# Altium project Controller.PrjPcb
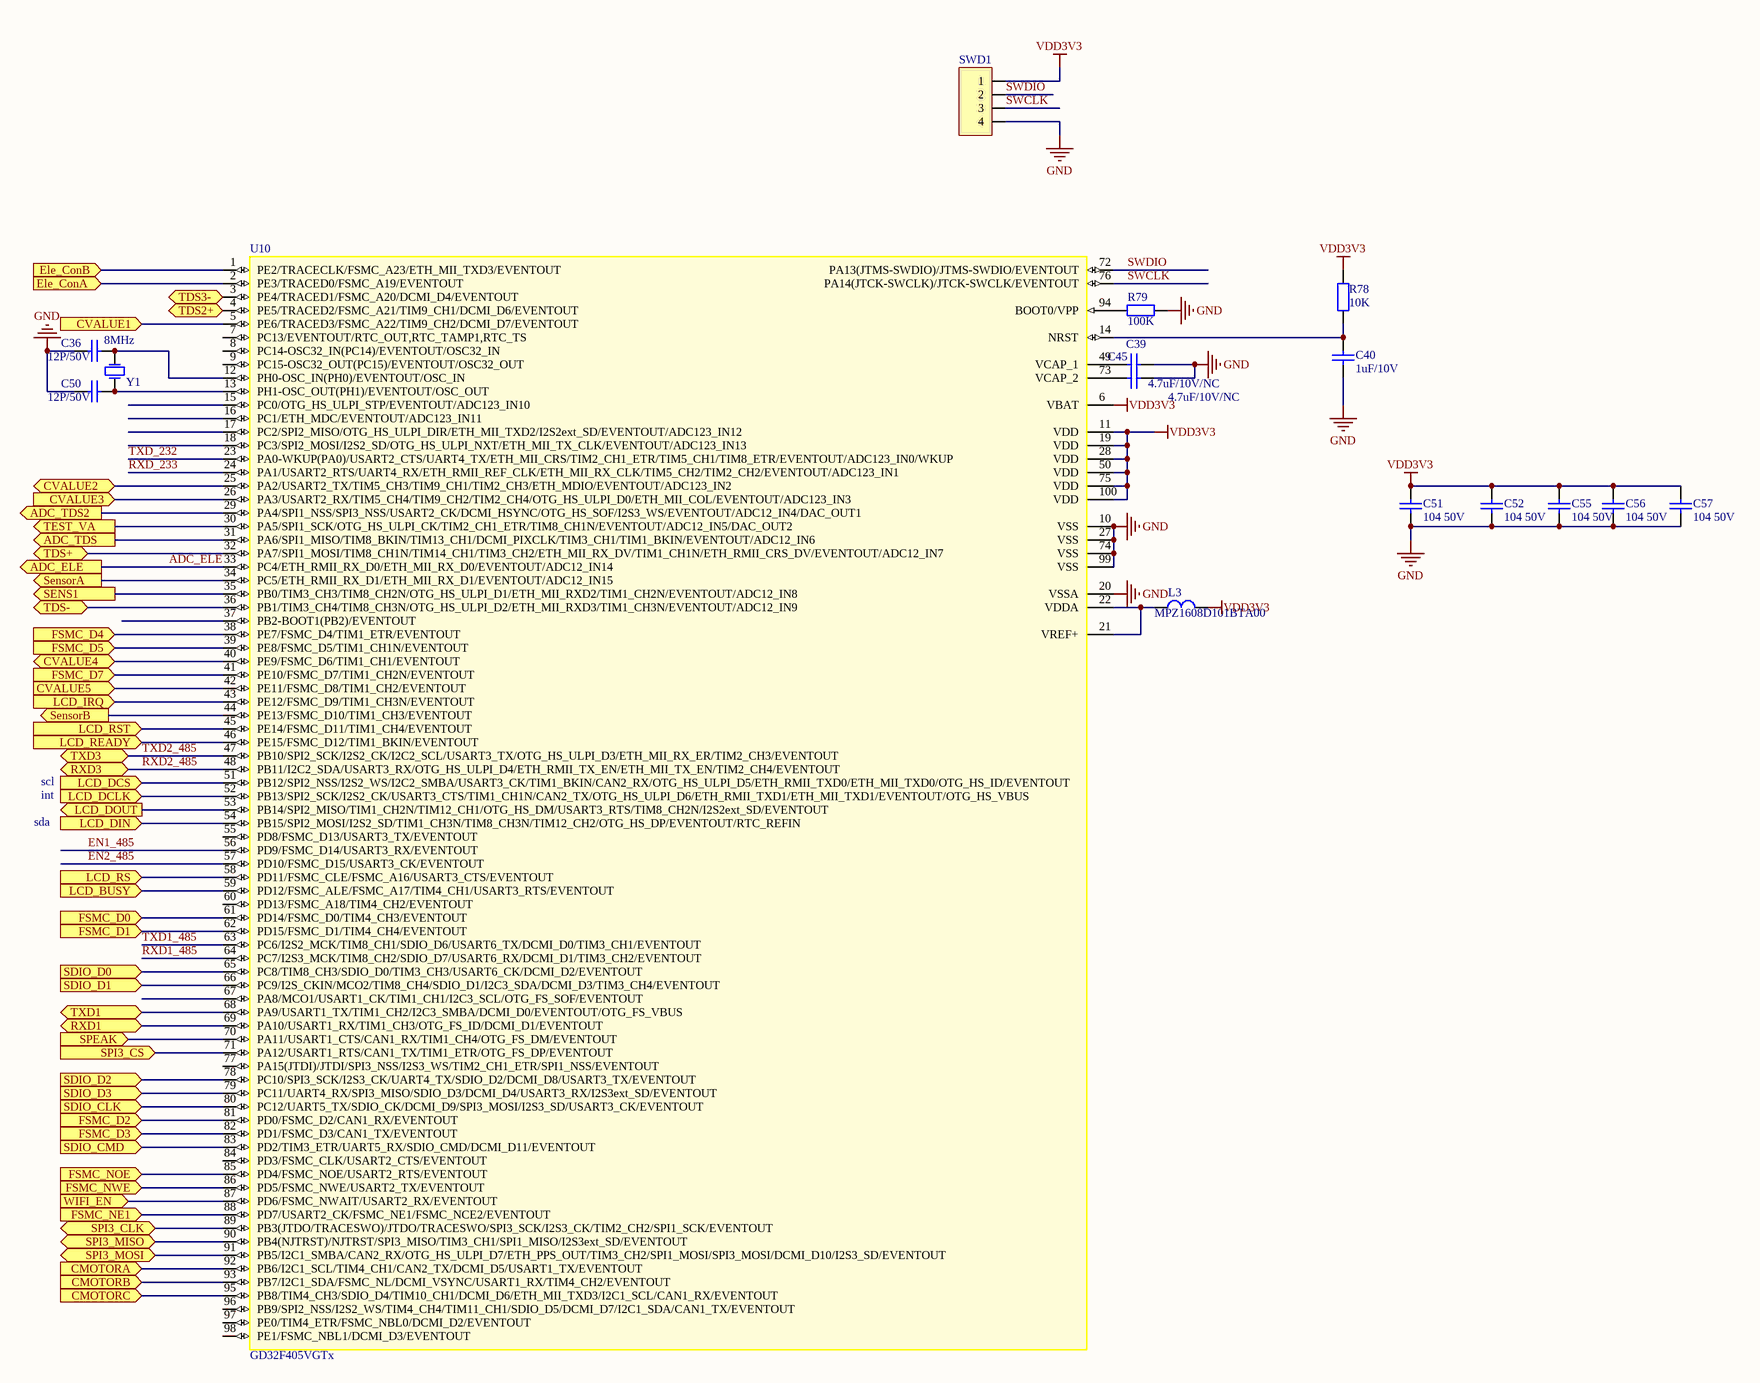
[diagram p0: cpu.SchDoc]
6 sheets, 170 parts. Net scope: global (net labels, ports and power ports of the same name join across sheets).
Board file: 电解模块主控板_V1.1_ZM_20211015.PcbDoc
Sheets:
  cpu.SchDoc
  08_Peripherals.SchDoc
  11_Speak.SchDoc
  02_Power.SchDoc
  com.SchDoc
  07_EL_CON.SchDoc

## Sheet cpu.SchDoc
size A2

### Parts
C36  12P/50V  [SMD-0603C]
C39  4.7uF/10V/NC  [SMD-0603C]
C40  1uF/10V  [SMD-0603C]
C45  4.7uF/10V/NC  [SMD-0603C]
C50  12P/50V  [SMD-0603C]
C51  104 50V  [SMD-0603C]
C52  104 50V  [SMD-0603C]
C55  104 50V  [SMD-0603C]
C56  104 50V  [SMD-0603C]
C57  104 50V  [SMD-0603C]
L3  MPZ1608D101BTA00  [SMD-0603]
R78  10K  [SMD-0603]
R79  100K  [SMD-0603]
SWD1  SIP-4 (NC)  [SIP-4]  (value not drawn)
U10  GD32F405VGTx  [STM-LQFP100_N]
Y1  8MHz  [XTAL-3225-2]

### Ports
ADC_ELE (out), ADC_TDS2 (out), ADC_TDS (out), CMOTORA (in), CMOTORB (in), CMOTORC (in), CVALUE1 (in), CVALUE2 (bidir), CVALUE3 (in), CVALUE4 (bidir), CVALUE5 (in), Ele_ConA (in), Ele_ConB (in), FSMC_D0 (in), FSMC_D1 (in), FSMC_D2 (in), FSMC_D3 (in), FSMC_D4 (in), FSMC_D5 (in), FSMC_D7 (in), FSMC_NE1 (in), FSMC_NOE (in), FSMC_NWE (in), LCD_BUSY (in), LCD_DCLK (in), LCD_DCS (in), LCD_DIN (in), LCD_DOUT (out), LCD_IRQ (in), LCD_READY (in), LCD_RS (in), LCD_RST (in), RXD1 (bidir), RXD3 (bidir), SDIO_CLK (in), SDIO_CMD (in), SDIO_D0 (in), SDIO_D1 (in), SDIO_D2 (in), SDIO_D3 (in), SENS1 (out), SensorA (out), SensorB (out), SPEAK (in), SPI3_CLK (bidir), SPI3_CS (in), SPI3_MISO (bidir), SPI3_MOSI (bidir), TDS2+ (bidir), TDS3- (bidir), TDS+ (bidir), TDS- (bidir), TEST_VA (out), TXD1 (bidir), TXD3 (bidir), WIFI_EN (in)

### Nets
GND: C36.2 C39.1 C40.1 C45.1 C50.2 C51.1 C52.1 C55.1 C56.1 C57.1 R79.1 SWD1.4 U10.10(VSS) U10.20(VSSA) U10.27(VSS) U10.74(VSS) U10.99(VSS)
VDD3V3: C51.2 C52.2 C55.2 C56.2 C57.2 L3.1 R78.2 SWD1.1 U10.6(VBAT) U10.11(VDD) U10.19(VDD) U10.28(VDD) U10.50(VDD) U10.75(VDD) U10.100(VDD)  [project net 3.3V]
ADC_ELE: U10.33(PC4/ETH_RMII_RX_D0/ETH_MII_RX_D0/EVENTOUT/ADC12_IN14) ; port ADC_ELE
EN1_485: U10.56(PD9/FSMC_D14/USART3_RX/EVENTOUT)
EN2_485: U10.57(PD10/FSMC_D15/USART3_CK/EVENTOUT)
RXD1_485: U10.64(PC7/I2S3_MCK/TIM8_CH2/SDIO_D7/USART6_RX/DCMI_D1/TIM3_CH2/EVENTOUT)
RXD2_485: U10.48(PB11/I2C2_SDA/USART3_RX/OTG_HS_ULPI_D4/ETH_RMII_TX_EN/ETH_MII_TX_EN/TIM2_CH4/EVENTOUT) ; port RXD3
RXD_233: U10.24(PA1/USART2_RTS/UART4_RX/ETH_RMII_REF_CLK/ETH_MII_RX_CLK/TIM5_CH2/TIM2_CH2/EVENTOUT/ADC123_IN1)
SWCLK: SWD1.3 U10.76(PA14(JTCK-SWCLK)/JTCK-SWCLK/EVENTOUT)
SWDIO: SWD1.2 U10.72(PA13(JTMS-SWDIO)/JTMS-SWDIO/EVENTOUT)
TXD1_485: U10.63(PC6/I2S2_MCK/TIM8_CH1/SDIO_D6/USART6_TX/DCMI_D0/TIM3_CH1/EVENTOUT)
TXD2_485: U10.47(PB10/SPI2_SCK/I2S2_CK/I2C2_SCL/USART3_TX/OTG_HS_ULPI_D3/ETH_MII_RX_ER/TIM2_CH3/EVENTOUT) ; port TXD3
TXD_232: U10.23(PA0-WKUP(PA0)/USART2_CTS/UART4_TX/ETH_MII_CRS/TIM2_CH1_ETR/TIM5_CH1/TIM8_ETR/EVENTOUT/ADC123_IN0/WKUP)
NetC36_1: C36.1 U10.12(PH0-OSC_IN(PH0)/EVENTOUT/OSC_IN) Y1.2(OSC2)
NetC39_2: C39.2 U10.49(VCAP_1)
NetC40_2: C40.2 R78.1 U10.14(NRST)
NetC45_2: C45.2 U10.73(VCAP_2)
NetC46_2: U10.30(PA5/SPI1_SCK/OTG_HS_ULPI_CK/TIM2_CH1_ETR/TIM8_CH1N/EVENTOUT/ADC12_IN5/DAC_OUT2) ; port TEST_VA
NetC50_1: C50.1 U10.13(PH1-OSC_OUT(PH1)/EVENTOUT/OSC_OUT) Y1.1(OSC1)
NetL3_2: L3.2 U10.21(VREF+) U10.22(VDDA)
NetR10_1: U10.2(PE3/TRACED0/FSMC_A19/EVENTOUT) ; port Ele_ConA
NetR18_1: U10.1(PE2/TRACECLK/FSMC_A23/ETH_MII_TXD3/EVENTOUT) ; port Ele_ConB
NetR31_2: U10.92(PB6/I2C1_SCL/TIM4_CH1/CAN2_TX/DCMI_D5/USART1_TX/EVENTOUT) ; port CMOTORA
NetR32_2: U10.93(PB7/I2C1_SDA/FSMC_NL/DCMI_VSYNC/USART1_RX/TIM4_CH2/EVENTOUT) ; port CMOTORB
NetR33_2: U10.95(PB8/TIM4_CH3/SDIO_D4/TIM10_CH1/DCMI_D6/ETH_MII_TXD3/I2C1_SCL/CAN1_RX/EVENTOUT) ; port CMOTORC
NetR37_2: U10.5(PE6/TRACED3/FSMC_A22/TIM9_CH2/DCMI_D7/EVENTOUT) ; port CVALUE1
NetR38_2: U10.25(PA2/USART2_TX/TIM5_CH3/TIM9_CH1/TIM2_CH3/ETH_MDIO/EVENTOUT/ADC123_IN2) ; port CVALUE2
NetR39_2: U10.26(PA3/USART2_RX/TIM5_CH4/TIM9_CH2/TIM2_CH4/OTG_HS_ULPI_D0/ETH_MII_COL/EVENTOUT/ADC123_IN3) ; port CVALUE3
NetR40_2: U10.40(PE9/FSMC_D6/TIM1_CH1/EVENTOUT) ; port CVALUE4
NetR41_2: U10.42(PE11/FSMC_D8/TIM1_CH2/EVENTOUT) ; port CVALUE5
NetR57_1: U10.70(PA11/USART1_CTS/CAN1_RX/TIM1_CH4/OTG_FS_DM/EVENTOUT) ; port SPEAK
NetR79_2: R79.2 U10.94(BOOT0/VPP)
NetU10_3: U10.3(PE4/TRACED1/FSMC_A20/DCMI_D4/EVENTOUT) ; port TDS3-
NetU10_4: U10.4(PE5/TRACED2/FSMC_A21/TIM9_CH1/DCMI_D6/EVENTOUT) ; port TDS2+
NetU10_29: U10.29(PA4/SPI1_NSS/SPI3_NSS/USART2_CK/DCMI_HSYNC/OTG_HS_SOF/I2S3_WS/EVENTOUT/ADC12_IN4/DAC_OUT1) ; port ADC_TDS2
NetU10_31: U10.31(PA6/SPI1_MISO/TIM8_BKIN/TIM13_CH1/DCMI_PIXCLK/TIM3_CH1/TIM1_BKIN/EVENTOUT/ADC12_IN6) ; port ADC_TDS
NetU10_32: U10.32(PA7/SPI1_MOSI/TIM8_CH1N/TIM14_CH1/TIM3_CH2/ETH_MII_RX_DV/TIM1_CH1N/ETH_RMII_CRS_DV/EVENTOUT/ADC12_IN7) ; port TDS+
NetU10_34: U10.34(PC5/ETH_RMII_RX_D1/ETH_MII_RX_D1/EVENTOUT/ADC12_IN15) ; port SensorA
NetU10_35: U10.35(PB0/TIM3_CH3/TIM8_CH2N/OTG_HS_ULPI_D1/ETH_MII_RXD2/TIM1_CH2N/EVENTOUT/ADC12_IN8) ; port SENS1
NetU10_36: U10.36(PB1/TIM3_CH4/TIM8_CH3N/OTG_HS_ULPI_D2/ETH_MII_RXD3/TIM1_CH3N/EVENTOUT/ADC12_IN9) ; port TDS-
NetU10_38: U10.38(PE7/FSMC_D4/TIM1_ETR/EVENTOUT) ; port FSMC_D4
NetU10_39: U10.39(PE8/FSMC_D5/TIM1_CH1N/EVENTOUT) ; port FSMC_D5
NetU10_41: U10.41(PE10/FSMC_D7/TIM1_CH2N/EVENTOUT) ; port FSMC_D7
NetU10_43: U10.43(PE12/FSMC_D9/TIM1_CH3N/EVENTOUT) ; port LCD_IRQ
NetU10_44: U10.44(PE13/FSMC_D10/TIM1_CH3/EVENTOUT) ; port SensorB
NetU10_45: U10.45(PE14/FSMC_D11/TIM1_CH4/EVENTOUT) ; port LCD_RST
NetU10_46: U10.46(PE15/FSMC_D12/TIM1_BKIN/EVENTOUT) ; port LCD_READY
NetU10_51: U10.51(PB12/SPI2_NSS/I2S2_WS/I2C2_SMBA/USART3_CK/TIM1_BKIN/CAN2_RX/OTG_HS_ULPI_D5/ETH_RMII_TXD0/ETH_MII_TXD0/OTG_HS_ID/EVENTOUT) ; port LCD_DCS
NetU10_52: U10.52(PB13/SPI2_SCK/I2S2_CK/USART3_CTS/TIM1_CH1N/CAN2_TX/OTG_HS_ULPI_D6/ETH_RMII_TXD1/ETH_MII_TXD1/EVENTOUT/OTG_HS_VBUS) ; port LCD_DCLK
NetU10_53: U10.53(PB14/SPI2_MISO/TIM1_CH2N/TIM12_CH1/OTG_HS_DM/USART3_RTS/TIM8_CH2N/I2S2ext_SD/EVENTOUT) ; port LCD_DOUT
NetU10_54: U10.54(PB15/SPI2_MOSI/I2S2_SD/TIM1_CH3N/TIM8_CH3N/TIM12_CH2/OTG_HS_DP/EVENTOUT/RTC_REFIN) ; port LCD_DIN
NetU10_58: U10.58(PD11/FSMC_CLE/FSMC_A16/USART3_CTS/EVENTOUT) ; port LCD_RS
NetU10_59: U10.59(PD12/FSMC_ALE/FSMC_A17/TIM4_CH1/USART3_RTS/EVENTOUT) ; port LCD_BUSY
NetU10_61: U10.61(PD14/FSMC_D0/TIM4_CH3/EVENTOUT) ; port FSMC_D0
NetU10_62: U10.62(PD15/FSMC_D1/TIM4_CH4/EVENTOUT) ; port FSMC_D1
NetU10_65: U10.65(PC8/TIM8_CH3/SDIO_D0/TIM3_CH3/USART6_CK/DCMI_D2/EVENTOUT) ; port SDIO_D0
NetU10_66: U10.66(PC9/I2S_CKIN/MCO2/TIM8_CH4/SDIO_D1/I2C3_SDA/DCMI_D3/TIM3_CH4/EVENTOUT) ; port SDIO_D1
NetU10_68: U10.68(PA9/USART1_TX/TIM1_CH2/I2C3_SMBA/DCMI_D0/EVENTOUT/OTG_FS_VBUS) ; port TXD1
NetU10_69: U10.69(PA10/USART1_RX/TIM1_CH3/OTG_FS_ID/DCMI_D1/EVENTOUT) ; port RXD1
NetU10_71: U10.71(PA12/USART1_RTS/CAN1_TX/TIM1_ETR/OTG_FS_DP/EVENTOUT) ; port SPI3_CS
NetU10_78: U10.78(PC10/SPI3_SCK/I2S3_CK/UART4_TX/SDIO_D2/DCMI_D8/USART3_TX/EVENTOUT) ; port SDIO_D2
NetU10_79: U10.79(PC11/UART4_RX/SPI3_MISO/SDIO_D3/DCMI_D4/USART3_RX/I2S3ext_SD/EVENTOUT) ; port SDIO_D3
NetU10_80: U10.80(PC12/UART5_TX/SDIO_CK/DCMI_D9/SPI3_MOSI/I2S3_SD/USART3_CK/EVENTOUT) ; port SDIO_CLK
NetU10_81: U10.81(PD0/FSMC_D2/CAN1_RX/EVENTOUT) ; port FSMC_D2
NetU10_82: U10.82(PD1/FSMC_D3/CAN1_TX/EVENTOUT) ; port FSMC_D3
NetU10_83: U10.83(PD2/TIM3_ETR/UART5_RX/SDIO_CMD/DCMI_D11/EVENTOUT) ; port SDIO_CMD
NetU10_85: U10.85(PD4/FSMC_NOE/USART2_RTS/EVENTOUT) ; port FSMC_NOE
NetU10_86: U10.86(PD5/FSMC_NWE/USART2_TX/EVENTOUT) ; port FSMC_NWE
NetU10_87: U10.87(PD6/FSMC_NWAIT/USART2_RX/EVENTOUT) ; port WIFI_EN
NetU10_88: U10.88(PD7/USART2_CK/FSMC_NE1/FSMC_NCE2/EVENTOUT) ; port FSMC_NE1
NetU10_89: U10.89(PB3(JTDO/TRACESWO)/JTDO/TRACESWO/SPI3_SCK/I2S3_CK/TIM2_CH2/SPI1_SCK/EVENTOUT) ; port SPI3_CLK
NetU10_90: U10.90(PB4(NJTRST)/NJTRST/SPI3_MISO/TIM3_CH1/SPI1_MISO/I2S3ext_SD/EVENTOUT) ; port SPI3_MISO
NetU10_91: U10.91(PB5/I2C1_SMBA/CAN2_RX/OTG_HS_ULPI_D7/ETH_PPS_OUT/TIM3_CH2/SPI1_MOSI/SPI3_MOSI/DCMI_D10/I2S3_SD/EVENTOUT) ; port SPI3_MOSI

Not connected (* = marked no-connect by the designer): U10 7(PC13/EVENTOUT/RTC_OUT,RTC_TAMP1,RTC_TS) 8(PC14-OSC32_IN(PC14)/EVENTOUT/OSC32_IN) 9(PC15-OSC32_OUT(PC15)/EVENTOUT/OSC32_OUT) 15(PC0/OTG_HS_ULPI_STP/EVENTOUT/ADC123_IN10) 16(PC1/ETH_MDC/EVENTOUT/ADC123_IN11) 17(PC2/SPI2_MISO/OTG_HS_ULPI_DIR/ETH_MII_TXD2/I2S2ext_SD/EVENTOUT/ADC123_IN12) 18(PC3/SPI2_MOSI/I2S2_SD/OTG_HS_ULPI_NXT/ETH_MII_TX_CLK/EVENTOUT/ADC123_IN13) 37(PB2-BOOT1(PB2)/EVENTOUT) 55(PD8/FSMC_D13/USART3_TX/EVENTOUT) 60(PD13/FSMC_A18/TIM4_CH2/EVENTOUT) 67(PA8/MCO1/USART1_CK/TIM1_CH1/I2C3_SCL/OTG_FS_SOF/EVENTOUT) 77(PA15(JTDI)/JTDI/SPI3_NSS/I2S3_WS/TIM2_CH1_ETR/SPI1_NSS/EVENTOUT) 84(PD3/FSMC_CLK/USART2_CTS/EVENTOUT) 96(PB9/SPI2_NSS/I2S2_WS/TIM4_CH4/TIM11_CH1/SDIO_D5/DCMI_D7/I2C1_SDA/CAN1_TX/EVENTOUT) 97(PE0/TIM4_ETR/FSMC_NBL0/DCMI_D2/EVENTOUT) 98(PE1/FSMC_NBL1/DCMI_D3/EVENTOUT)

### Notes on the sheet
- scl
- int
- sda

### Library data of the parts
C36 C50 = CAP4: 贴片电容 5%
C39 C40 C45 C51 C52 C55-C57 = CAP4: 贴片电容 20%
L3 = CIZHU1: 磁珠电感 100R 100MHz
R78 R79 = RES2: 贴片电阻 5%
SWD1 = SIP-4: ISP 下载
U10 = STM32F405VGTx: Manufacturer: STMicroelectronics; PartNumber: STM32F405VGT6; Core: ARM Cortex-M4; D/A Converter: 2x12-bit; FLASH Size (Prog) (kB): 1024; I/Os (High Current): 82; Internal RAM Size (kB): 192; Operating Frequency(F) (Processor speed) (MHz): 168; Packing: Tray; Supply Voltage(Vcc) max (V): 3.6; Supply Voltage(Vcc) min (V): 1.8; DatasheetVersion: Rev. 4; PackageVersion: Rev. 1, 06/2013; PackageReference: LQFP100; PackageDescription: 100-Pin Low Profile Quad Flat Package, 14 x 14 mm Body, 0.5 mm Pitch; Mounting Technology: Surface Mount; ComponentLink1Description: Manufacturer URL; ComponentLink1URL: http://www.st.com/web/en/home.html; ComponentLink2Description: Datasheet; ComponentLink2URL: http://www.st.com/st-web-ui/static/active/en/resource/technical/document/datasheet/DM00037051.pdf; ComponentLink3Description: Package Specification; ComponentLink3URL: http://www.st.com/st-web-ui/static/active/en/resource/technical/document/data_brief/DM00071938.pdf
Y1 = XTAL: 3225 贴片晶振

## Sheet 08_Peripherals.SchDoc
size A4
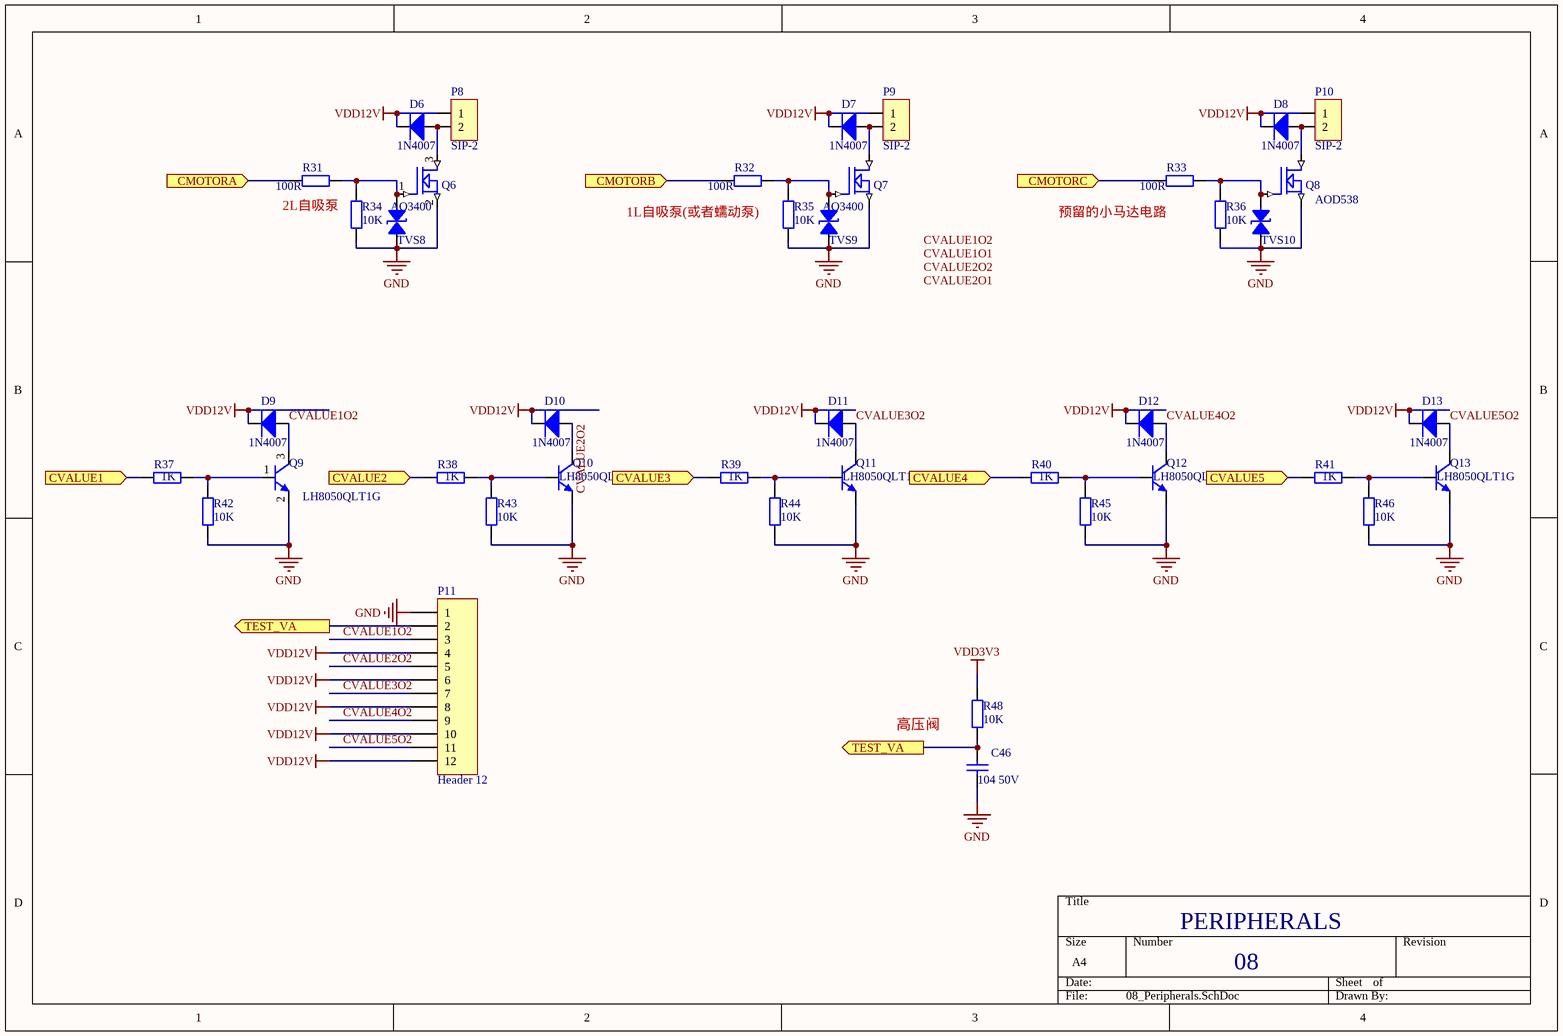
[diagram p1: 08_Peripherals.SchDoc]

### Parts
(Parts that share a designator on the sheet are numbered #1, #2 ... from top to bottom, then left to right.)
C46  104 50V  [SMD-0603C]
D6#1  1N4007  [DO-214-AC]
D7#1  1N4007  [DO-214-AC]
D8  1N4007  [DO-214-AC]
D9  1N4007  [DO-214-AC]
D10  1N4007  [DO-214-AC]
D11  1N4007  [DO-214-AC]
D12  1N4007  [DO-214-AC]
D13  1N4007  [DO-214-AC]
P8  SIP-2  [SIP-2A]
P9  SIP-2  [SIP-2A]
P10  SIP-2  [VH-AW-3.96*2P]
P11  Header 12  [12X2.54MMZ]
Q6  AO3400  [SOT-23]
Q7  AO3400  [SOT-23]
Q8  AOD538  [TO252]
Q9  LH8050QLT1G  [SOT-23]
Q10  LH8050QLT1G  [SOT-23]
Q11  LH8050QLT1G  [SOT-23]
Q12  LH8050QLT1G  [SOT-23]
Q13  LH8050QLT1G  [SOT-23]
R31  100R  [SMD-0603]
R32  100R  [SMD-0603]
R33  100R  [SMD-0603]
R34  10K  [SMD-0603]
R35  10K  [SMD-0603]
R36  10K  [SMD-0603]
R37  1K  [SMD-0603]
R38  1K  [SMD-0603]
R39  1K  [SMD-0603]
R40  1K  [SMD-0603]
R41  1K  [SMD-0603]
R42  10K  [SMD-0603]
R43  10K  [SMD-0603]
R44  10K  [SMD-0603]
R45  10K  [SMD-0603]
R46  10K  [SMD-0603]
R48  10K  [SMD-0603]
TVS8  ESD5Z5.0CT1G  [SOD-523]  (value not drawn)
TVS9  ESD5Z5.0CT1G  [SOD-523]  (value not drawn)
TVS10  ESD5Z5.0CT1G  [SOD-523]  (value not drawn)

### Ports
CMOTORA (in), CMOTORB (in), CMOTORC (in), CVALUE1 (in), CVALUE2 (in), CVALUE3 (in), CVALUE4 (in), CVALUE5 (in), TEST_VA (out)

### Nets
GND: C46.1 P11.1 Q6.2(S) Q7.2(S) Q8.2(S) Q9.2(E) Q10.2(E) Q11.2(E) Q12.2(E) Q13.2(E) R34.2 R35.2 R36.2 R42.2 R43.2 R44.2 R45.2 R46.2 TVS8.1(A) TVS9.1(A) TVS10.1(A)
VDD3V3: R48.2  [project net 3.3V]
VDD12V: D6#1.2(K) D7#1.2(K) D8.2(K) D9.2(K) D10.2(K) D11.2(K) D12.2(K) D13.2(K) P8.1 P9.1 P10.1 P11.4 P11.6 P11.8 P11.10 P11.12
CVALUE1O2: D9.1(A) P11.3 Q9.3(C)
CVALUE2O2: D10.1(A) P11.5 Q10.3(C)
CVALUE3O2: D11.1(A) P11.7 Q11.3(C)
CVALUE4O2: D12.1(A) P11.9 Q12.3(C)
CVALUE5O2: D13.1(A) P11.11 Q13.3(C)
NetC46_2: C46.2 P11.2 R48.1 ; port TEST_VA
NetD6#1_1: D6#1.1(A) P8.2 Q6.3(D)
NetD7#1_1: D7#1.1(A) P9.2 Q7.3(D)
NetD8_1: D8.1(A) P10.2 Q8.3(D)
NetQ6_1: Q6.1(G) R31.1 R34.1 TVS8.2(B)
NetQ7_1: Q7.1(G) R32.1 R35.1 TVS9.2(B)
NetQ8_1: Q8.1(G) R33.1 R36.1 TVS10.2(B)
NetQ9_1: Q9.1(B) R37.1 R42.1
NetQ10_1: Q10.1(B) R38.1 R43.1
NetQ11_1: Q11.1(B) R39.1 R44.1
NetQ12_1: Q12.1(B) R40.1 R45.1
NetQ13_1: Q13.1(B) R41.1 R46.1
NetR31_2: R31.2 ; port CMOTORA
NetR32_2: R32.2 ; port CMOTORB
NetR33_2: R33.2 ; port CMOTORC
NetR37_2: R37.2 ; port CVALUE1
NetR38_2: R38.2 ; port CVALUE2
NetR39_2: R39.2 ; port CVALUE3
NetR40_2: R40.2 ; port CVALUE4
NetR41_2: R41.2 ; port CVALUE5

### Notes on the sheet
- (near R31) 2L自吸泵
- (near R32) 1L自吸泵(或者蠕动泵)
- 预留的小马达电路
- 高压阀
- PERIPHERALS
- 08
- Labels drawn without touching a wire or pin: CVALUE1O1, CVALUE1O2, CVALUE2O1, CVALUE2O2

### Library data of the parts
C46 = CAP4: 贴片电容 10%
D6#1 D7#1 D8-D13 = DIODE2: 贴片二极管
P8-P10 = SIP-2: XH2.54 2P 立贴
P11 = Header 12: Header, 12-Pin; LatestRevisionDate: 17-Jul-2002; LatestRevisionNote: Re-released for DXP Platform.; Publisher: Altium Limited
Q6-Q8 = MOSFET N
Q9-Q13 = NPN-1: 三极管
R31-R46 R48 = RES-SOP: 贴片电阻 5%
TVS8-TVS10 = TVS-1: TVS

## Sheet 11_Speak.SchDoc
size A4
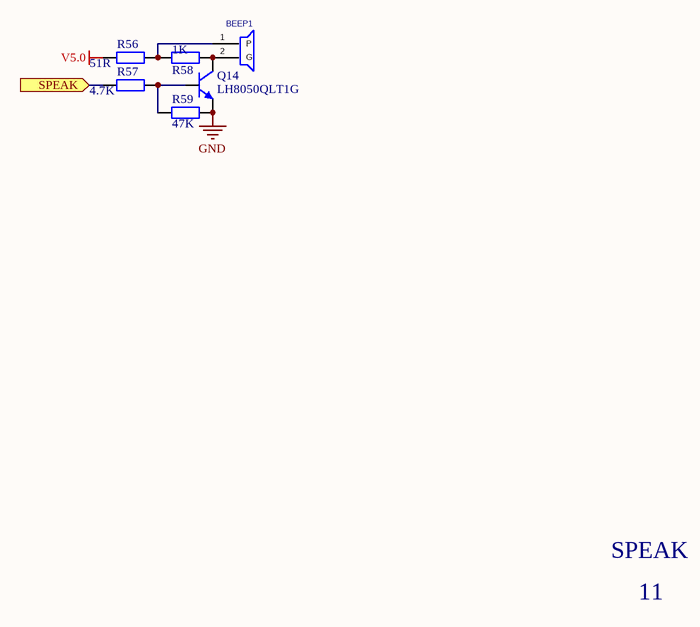
[diagram p2: 11_Speak.SchDoc]

### Parts
BEEP1  BEEP-9.5X5.5  [BEEP-9.5X5.5]  (value not drawn)
Q14  LH8050QLT1G  [SOT-23]
R56  51R  [SMD-0603]
R57  4.7K  [SMD-0603]
R58  1K  [SMD-0603]
R59  47K  [SMD-0603]

### Ports
SPEAK (in)

### Nets
GND: Q14.2(E) R59.2
V5.0: R56.2
NetBEEP1_1: BEEP1.1(P) R56.1 R58.2
NetBEEP1_2: BEEP1.2(G) Q14.3(C) R58.1
NetQ14_1: Q14.1(B) R57.2 R59.1
NetR57_1: R57.1 ; port SPEAK

### Notes on the sheet
- SPEAK
- 11

### Library data of the parts
Q14 = NPN-1: NPN
R56-R59 = RES0: 贴片电阻 5%
BEEP1 = BEEP-9.5X5.5: PCB DECAL: BEEP-9.5X5.5

## Sheet 02_Power.SchDoc
size A4
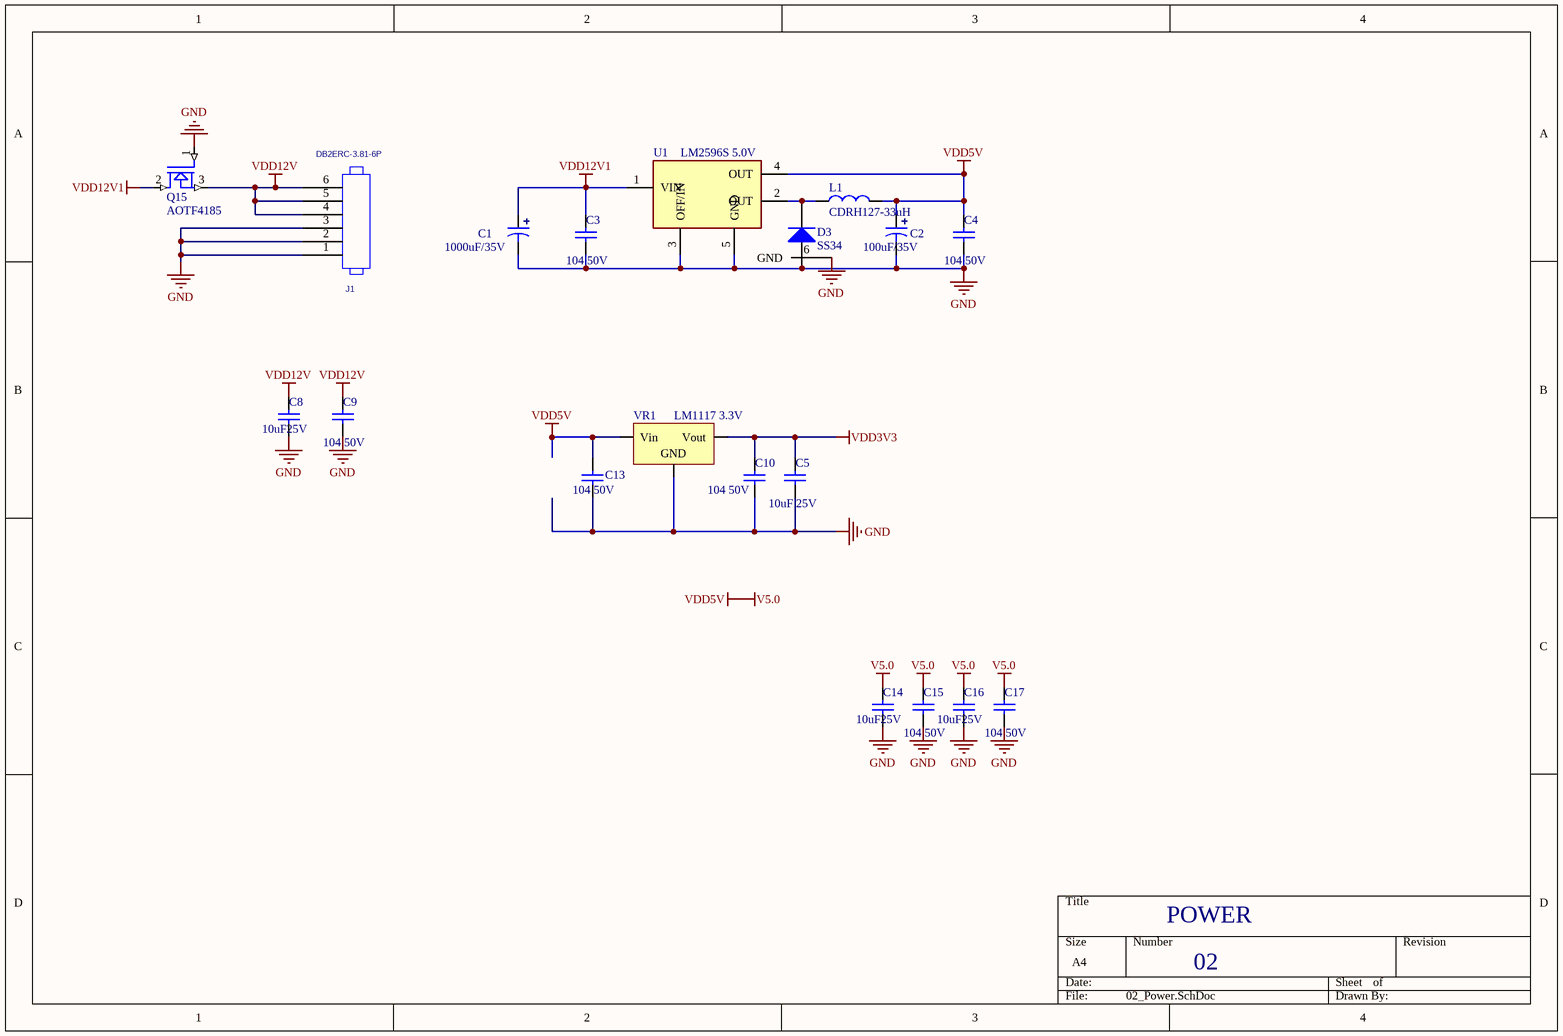
[diagram p3: 02_Power.SchDoc]

### Parts
C1  1000uF/35V  [10*16]
C2  100uF/35V  [6*8]
C3  104 50V  [SMD-0805C]
C4  104 50V  [SMD-0805C]
C5  10uF 25V  [SMD-0603C]
C8  10uF25V  [SMD-0603C]
C9  104 50V  [SMD-0603C]
C10  104 50V  [SMD-0603C]
C13  104 50V  [SMD-0603C]
C14  10uF25V  [SMD-0603C]
C15  104 50V  [SMD-0603C]
C16  10uF25V  [SMD-0603C]
C17  104 50V  [SMD-0603C]
D3  SS34  [SMA]
J1  value DB2ERC-3.81-6P  [VH-AW-3.96*6P]  (hidden comment: HEADER_6)
L1  CDRH127-33uH  [CDRH-127]
Q15  AOTF4185  [to220]
U1  LM2596S 5.0V  [TO-263-5]
VR1  LM1117 3.3V  [SOT223]

### Nets
GND: C1.2 C2.2 C3.1 C4.1 C5.1 C8.1 C9.1 C10.1 C13.1 C14.1 C15.1 C16.1 C17.1 D3.1(A) J1.1 J1.2 J1.3 Q15.1(G) U1.3(OFF/IN) U1.5(GND) U1.6(GND) VR1.1(GND)
V5.0: C2.1 C4.2 C13.2 C14.2 C15.2 C16.2 C17.2 L1.2 U1.4(OUT) VR1.3(Vin)  [also labelled VDD5V]
VDD3V3: C5.2 C10.2 VR1.2(Vout)  [project net 3.3V]
VDD12V: C8.2 C9.2 J1.4 J1.5 J1.6 Q15.3(S)
VDD12V1: C1.1 C3.2 Q15.2(D) U1.1(VIN)
NetD3_2: D3.2(K) L1.1 U1.2(OUT)

### Notes on the sheet
- POWER
- 02

### Library data of the parts
C1 C2 = CAP2: 电解电容
C3 C4 C8-C10 C13 = CAP4: 贴片电容 10%
C5 C14-C17 = CAP4: 贴片电容 20%
D3 = DIODE
J1 = HEADER_6: PCB DECAL: DB2ERC-3P81-6P; Source_Path: C:\MYPROGRAM\CADENCE\SPB_16.6\TOOLS\CAPTURE\LIBRARY\CONNECTOR.OLB
L1 = IND
Q15 = MOSFET N
U1 = LM2596
VR1 = LM1117: 三端稳压器

## Sheet com.SchDoc
size A4
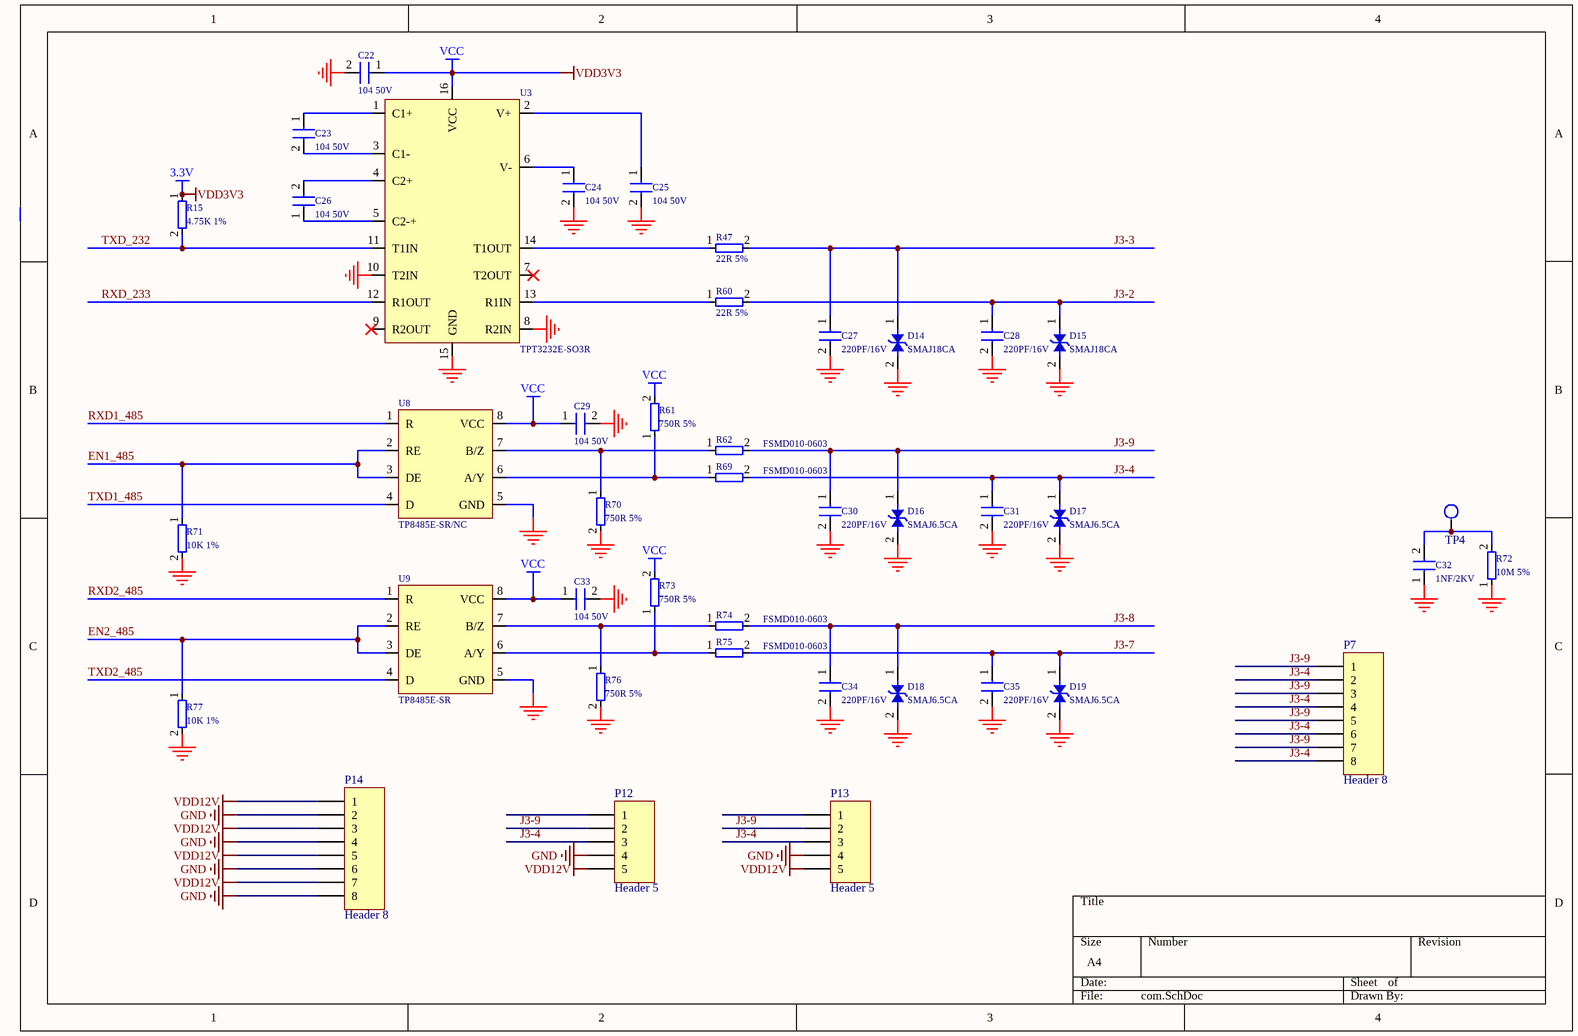
[diagram p4: com.SchDoc]

### Parts
(Parts that share a designator on the sheet are numbered #1, #2 ... from top to bottom, then left to right.)
C22  104 50V  [0603C]
C23  104 50V  [0603C]
C24  104 50V  [0603C]
C25  104 50V  [0603C]
C26  104 50V  [0603C]
C27  220PF/16V  [0603C]
C28  220PF/16V  [0603C]
C29  104 50V  [0603C]
C30  220PF/16V  [0603C]
C31  220PF/16V  [0603C]
C32  1NF/2KV  [1206C]
C33#1  104 50V  [0603C]
C34  220PF/16V  [0603C]
C35  220PF/16V  [0603C]
D14  SMAJ18CA  [SMA]
D15  SMAJ18CA  [SMA]
D16  SMAJ6.5CA  [SMA]
D17  SMAJ6.5CA  [SMA]
D18  SMAJ6.5CA  [SMA]
D19  SMAJ6.5CA  [SMA]
P7  Header 8  [8X2.54MMZ]
P12  Header 5  [5X2.54MMZ]
P13  Header 5  [5X2.54MMZ]
P14  Header 8  [8X2.54MMZ]
R15#1  4.75K 1%  [0603R]
R47  22R 5%  [0603R]
R60  22R 5%  [0603R]
R61  750R 5%  [0603R]
R62  FSMD010-0603  [0603R]
R69  FSMD010-0603  [0603R]
R70  750R 5%  [0603R]
R71  10K 1%  [0603R]
R72  10M 5%  [1206r]
R73  750R 5%  [0603R]
R74  FSMD010-0603  [0603R]
R75  FSMD010-0603  [0603R]
R76  750R 5%  [0603R]
R77  10K 1%  [0603R]
TP4#1  TPS  [tpd]  (value not drawn)
U3  TPT3232E-SO3R  [SO-16Z]
U8  TP8485E-SR/NC  [SO-8]
U9  TP8485E-SR  [SO-8]

### Nets
3.3V: C22.1 C29.1 C33#1.1 R15#1.1 R61.2 R73.2 U3.16(VCC) U8.8(VCC) U9.8(VCC)  [also labelled VCC, VDD3V3]
GND: C22.2 C24.2 C25.2 C27.2 C28.2 C29.2 C30.2 C31.2 C32.1 C33#1.2 C34.2 C35.2 D14.2 D15.2 D16.2 D17.2 D18.2 D19.2 P12.4 P13.4 P14.2 P14.4 P14.6 P14.8 R70.2 R71.2 R72.1 R76.2 R77.2 U3.8(R2IN) U3.10(T2IN) U3.15(GND) U8.5(GND) U9.5(GND)
VDD12V: P12.5 P13.5 P14.1 P14.3 P14.5 P14.7
EN1_485: R71.1 U8.2(RE) U8.3(DE)
EN2_485: R77.1 U9.2(RE) U9.3(DE)
J3-2: C28.1 D15.1 R60.2
J3-3: C27.1 D14.1 R47.2
J3-4: C31.1 D17.1 P7.2 P7.4 P7.6 P7.8 P12.3 P13.3 R69.2
J3-7: C35.1 D19.1 R75.2
J3-8: C34.1 D18.1 R74.2
J3-9: C30.1 D16.1 P7.1 P7.3 P7.5 P7.7 P12.2 P13.2 R62.2
RXD1_485: U8.1(R)
RXD2_485: U9.1(R)
RXD_233: U3.12(R1OUT)
TXD1_485: U8.4(D)
TXD2_485: U9.4(D)
TXD_232: R15#1.2 U3.11(T1IN)
NetC23_1: C23.1 U3.1(C1+)
NetC23_2: C23.2 U3.3(C1-)
NetC24_1: C24.1 U3.6(V-)
NetC25_1: C25.1 U3.2(V+)
NetC26_1: C26.1 U3.5(C2-+)
NetC26_2: C26.2 U3.4(C2+)
NetC32_2: C32.2 R72.2 TP4#1.1
NetR47_1: R47.1 U3.14(T1OUT)
NetR60_1: R60.1 U3.13(R1IN)
NetR61_1: R61.1 R69.1 U8.6(A/Y)
NetR62_1: R62.1 R70.1 U8.7(B/Z)
NetR73_1: R73.1 R75.1 U9.6(A/Y)
NetR74_1: R74.1 R76.1 U9.7(B/Z)

Not connected (* = marked no-connect by the designer): P12 1; P13 1; U3 7(T2OUT)* 9(R2OUT)*

### Library data of the parts
C22-C32 C33#1 C34 C35 = CAP
D14-D19 = D_ESD
P7 P14 = Header 8: Header, 8-Pin; LatestRevisionDate: 17-Jul-2002; LatestRevisionNote: Re-released for DXP Platform.; Publisher: Altium Limited
P12 P13 = Header 5: Header, 5-Pin; LatestRevisionDate: 17-Jul-2002; LatestRevisionNote: Re-released for DXP Platform.; Publisher: Altium Limited
R15#1 R47 R60-R62 R69-R77 = RES
U8 = TP8485E-SR

## Sheet 07_EL_CON.SchDoc
size A3
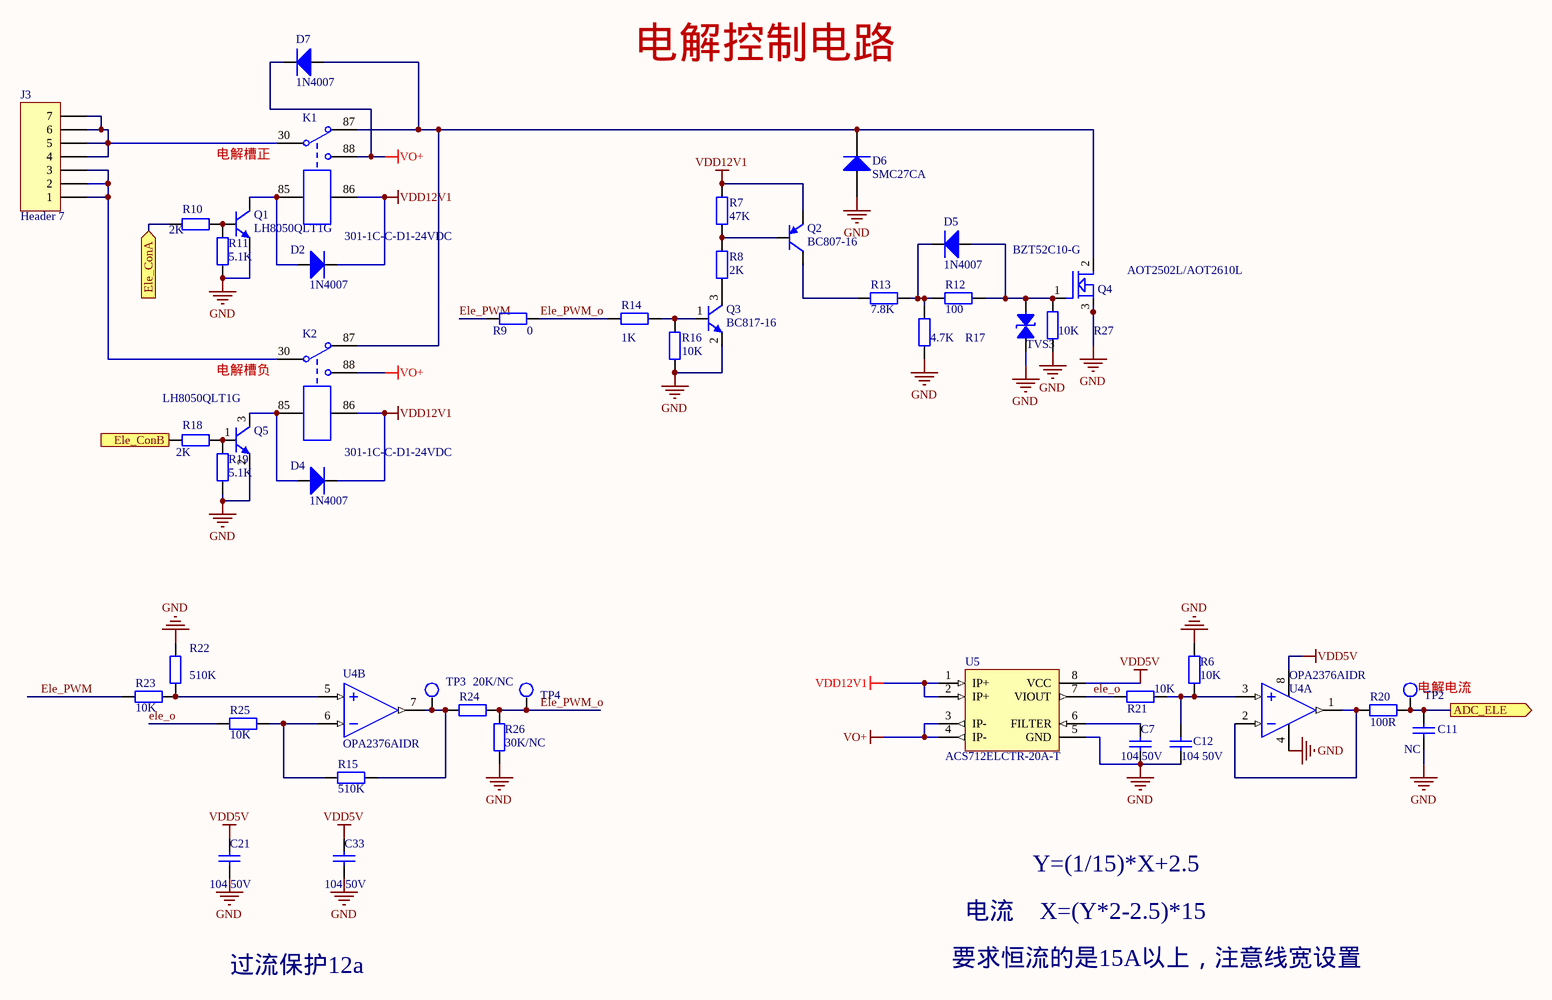
[diagram p5: 07_EL_CON.SchDoc]

### Parts
(Parts that share a designator on the sheet are numbered #1, #2 ... from top to bottom, then left to right.)
C7  104 50V  [SMD-0603C]
C11  NC  [SMD-0603C]
C12  104 50V  [SMD-0603C]
C21  104 50V  [SMD-0603C]
C33#2  104 50V  [SMD-0603C]
D2  1N4007  [DO-214-AC]
D4  1N4007  [DO-214-AC]
D5  1N4007  [DO-214-AC]
D6#2  SMC27CA  [SMC]
D7#2  1N4007  [DO-214-AC]
J3  Header 7  [VH-AW-3.96*7P]
K1  301-1C-C-D1-24VDC  [301-1C-C-R1-24VDC]
K2  301-1C-C-D1-24VDC  [301-1C-C-R1-24VDC]
Q1  LH8050QLT1G  [SOT-23]
Q2  BC807-16  [SOT-23]
Q3  BC817-16  [SOT-23]
Q4  AOT2502L/AOT2610L  [to220]
Q5  LH8050QLT1G  [SOT-23]
R6  10K  [SMD-0603]
R7  47K  [SMD-0603]
R8  2K  [SMD-0603]
R9  0  [SMD-0603]
R10  2K  [SMD-0603]
R11  5.1K  [SMD-0603]
R12  100  [SMD-0603]
R13  7.8K  [SMD-0603]
R14  1K  [SMD-0603]
R15#2  510K  [SMD-0603]
R16  10K  [SMD-0603]
R17  4.7K  [SMD-0603]
R18  2K  [SMD-0603]
R19  5.1K  [SMD-0603]
R20  100R  [SMD-0603]
R21  10K  [SMD-0603]
R22  510K  [SMD-0603]
R23  10K  [SMD-0603]
R24  20K/NC  [SMD-0603]
R25  10K  [SMD-0603]
R26  30K/NC  [SMD-0603]
R27  10K  [SMD-0603]
TP2  TPS  [tpd]  (value not drawn)
TP3  TPS  [tpd]  (value not drawn)
TP4#2  TPS  [tpd]  (value not drawn)
TVS3  BZT52C10-G  [SOD-123]
U4  OPA2376AIDR  [SO-8]  (parts A,B of 2)
U5  ACS712ELCTR-20A-T  [SO-8]

### Ports
ADC_ELE (out), Ele_ConA (in), Ele_ConB (in)

### Nets
GND: C7.2 C11.1 C12.2 C21.1 C33#2.1 D6#2.1(A) Q1.2(E) Q3.2(E) Q4.3(S) Q5.2(E) R6.1 R11.1 R16.1 R17.2 R19.1 R22.2 R26.2 R27.2 TVS3.1(A) U4.4(V-) U5.5(GND)
VDD5V: C21.2 C33#2.2 U4.8(V+) U5.8(VCC)  [project net V5.0]
VDD12V1: D2.2(K) D4.2(K) K1.86 K2.86 Q2.2(E) R7.2 U5.1(IP+) U5.2(IP+)
VO+: D7#2.2(K) K1.88 K2.88 U5.3(IP-) U5.4(IP-)
ADC_ELE: C11.2 R20.1 TP2.1 ; port ADC_ELE
ele_o: R21.2 R25.2 U5.7(VIOUT)
Ele_PWM: R9.2 R23.2
Ele_PWM_o: R9.1 R14.2 R24.1 R26.1 TP4#2.1
NetC7_1: C7.1 U5.6(FILTER)
NetC12_1: C12.1 R6.2 R21.1 U4.3(IN1+)
NetD2_1: D2.1(A) K1.85 Q1.3(C)
NetD4_1: D4.1(A) K2.85 Q5.3(C)
NetD5_1: D5.1(A) Q4.1(G) R12.2 R27.1 TVS3.2(B)
NetD5_2: D5.2(K) R12.1 R13.1 R17.1
NetD6#2_2: D6#2.2(K) D7#2.1(A) K1.87 K2.87 Q4.2(D)
NetJ3_1: J3.1 J3.2 J3.3 K2.30
NetJ3_4: J3.4 J3.5 J3.6 J3.7 K1.30
NetQ1_1: Q1.1(B) R10.2 R11.2
NetQ2_1: Q2.1(B) R7.1 R8.2
NetQ2_3: Q2.3(C) R13.2
NetQ3_1: Q3.1(B) R14.1 R16.2
NetQ3_3: Q3.3(C) R8.1
NetQ5_1: Q5.1(B) R18.2 R19.2
NetR10_1: R10.1 ; port Ele_ConA
NetR15#2_1: R15#2.1 R24.2 TP3.1 U4.7(OUT2)
NetR15#2_2: R15#2.2 R25.1 U4.6(IN2-)
NetR18_1: R18.1 ; port Ele_ConB
NetR20_2: R20.2 U4.1(OUT1) U4.2(IN1-)
NetR22_1: R22.1 R23.1 U4.5(IN2+)

### Notes on the sheet
- 电解控制电路
- 电解槽正
- 电解槽负
- (near TP2) 电解电流
- Y=(1/15)*X+2.5
- 过流保护12a
- 要求恒流的是15A以上，注意线宽设置
- 电流
- X=(Y*2-2.5)*15

### Library data of the parts
C7 = C: 贴片电容 10%
C11 C12 = CAP4: 贴片电容 10%
C21 C33#2 = CAP4: 贴片电容 20%
D2 D4 D5 D7#2 = DIODE2: 贴片二极管
D6#2 = DIODE
J3 = Header 7: Header, 7-Pin; LatestRevisionDate: 17-Jul-2002; LatestRevisionNote: Re-released for DXP Platform.; Publisher: Altium Limited
K1 K2 = JDQ1: 5V 继电器
Q1 Q3 Q5 = NPN-1: 三极管
Q2 = PNP
Q4 = SI7860
R6 R21 = RES0: 贴片电阻 1%
R7-R9 R12-R14 R15#2 R16 R17 R22-R27 = RES-SOP: 贴片电阻 5%
R10 R11 R18 R19 = RES2: 贴片电阻 5%
R20 = RES0: 贴片电阻 5%
TVS3 = TVS-1: TVS 10V
U4 = LM358: 运算放大器
U5 = ACS712: HALL 20A 电流传感器

## Nets that join several sheets
3.3V: cpu (15 pins), 08_Peripherals (R48.2), 02_Power (C5.2 C10.2 VR1.2), com (9 pins)
GND: cpu (17 pins), 08_Peripherals (21 pins), 11_Speak (Q14.2 R59.2), 02_Power (22 pins), com (34 pins), 07_EL_CON (21 pins)
V5.0: 11_Speak (R56.2), 02_Power (10 pins), 07_EL_CON (C21.2 C33#2.2 U4.8 U5.8)
VDD12V: 08_Peripherals (16 pins), 02_Power (6 pins), com (6 pins)
VDD12V1: 02_Power (C1.1 C3.2 Q15.2 U1.1), 07_EL_CON (8 pins)
ADC_ELE: cpu (U10.33), 07_EL_CON (C11.2 R20.1 TP2.1)
EN1_485: cpu (U10.56), com (R71.1 U8.2 U8.3)
EN2_485: cpu (U10.57), com (R77.1 U9.2 U9.3)
NetC46_2: cpu (U10.30), 08_Peripherals (C46.2 P11.2 R48.1)
NetR10_1: cpu (U10.2), 07_EL_CON (R10.1)
NetR18_1: cpu (U10.1), 07_EL_CON (R18.1)
NetR31_2: cpu (U10.92), 08_Peripherals (R31.2)
NetR32_2: cpu (U10.93), 08_Peripherals (R32.2)
NetR33_2: cpu (U10.95), 08_Peripherals (R33.2)
NetR37_2: cpu (U10.5), 08_Peripherals (R37.2)
NetR38_2: cpu (U10.25), 08_Peripherals (R38.2)
NetR39_2: cpu (U10.26), 08_Peripherals (R39.2)
NetR40_2: cpu (U10.40), 08_Peripherals (R40.2)
NetR41_2: cpu (U10.42), 08_Peripherals (R41.2)
NetR57_1: cpu (U10.70), 11_Speak (R57.1)
RXD1_485: cpu (U10.64), com (U8.1)
RXD2_485: cpu (U10.48), com (U9.1)
RXD_233: cpu (U10.24), com (U3.12)
TXD1_485: cpu (U10.63), com (U8.4)
TXD2_485: cpu (U10.47), com (U9.4)
TXD_232: cpu (U10.23), com (R15#1.2 U3.11)